# Altium schematic sheet MainPowerBoard.SchDoc
size B; SheetNumber: 2; SheetTotal: 5
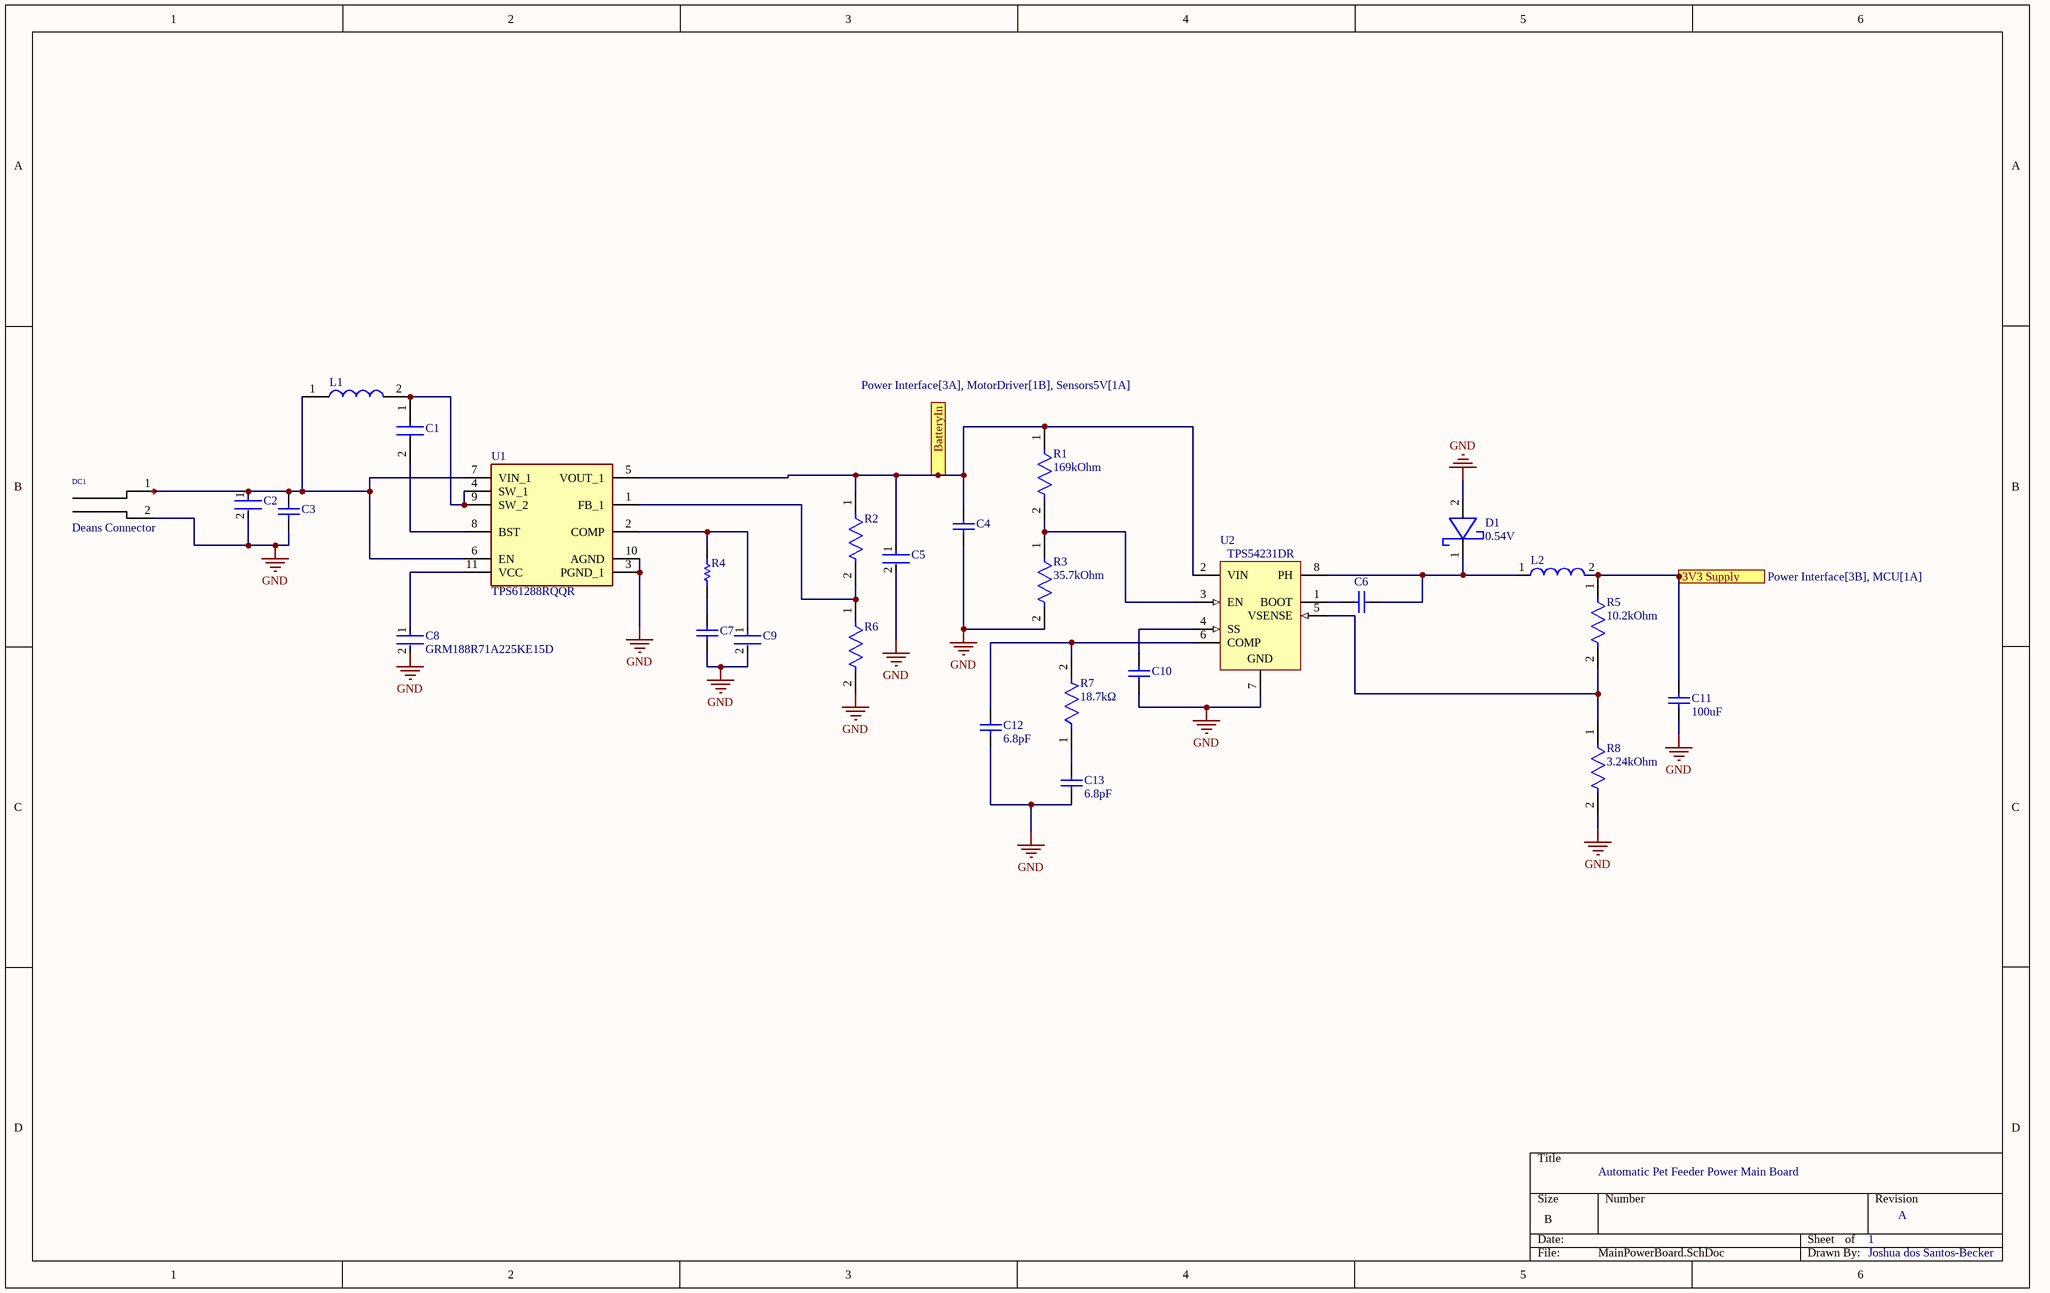
[diagram p0: MainPowerBoard.SchDoc]

## Parts
C1  EMK107B7104KA-T  [CAPC1608X95N]  (value not drawn)
C2  GRM188R60J106ME47D  [FP-GRM188-0_1-e0_2_0_55-IPC_A]  (value not drawn)
C3  GRM188R71H104KA93D  [CAPC1608X90X35ML10T15]  (value not drawn)
C4  (no value)  [FP-GRM32-IPC_A]
C5  GRM32ER61C476KE15L  [FP-GRM32E-0_3-0_2-IPC_C]  (value not drawn)
C6  (no value)  [CAPC1005X55X25LL05T10]
C7  GRM155R61A393KA01D  [CAPC1005X55X25NL05T10]  (value not drawn)
C8  GRM188R71A225KE15D  [FP-GRM188-0_1-e0_2_0_5-MFG]
C9  CL21C101JBANNNC  [FP-CL21-IPC_C]  (value not drawn)
C10  (no value)  [CAPC1005X55X25LL05T10]
C11  100uF  [CAP_0805]
C12  6.8pF  [Ccomp2]
C13  6.8pF  [Ccomp]
D1  0.54V  [SODFL260X100-2N]
DC1  Deans Connector  [Deans]
L1  XAL7070-222MEB  [XAL7070332MEB]  (value not drawn)
L2  (no value)  [WE-TI-L]
R1  169kOhm  [FP-CRCW0402-e3-IPC_B]
R2  CRCW0805931KFKEA  [RESC2012X50N]  (value not drawn)
R3  35.7kOhm  [FP-CRCW0402-e3-MFG]
R4  CRCW060339K2FKEA  [RESC1609X50X30LL10T20]  (value not drawn)
R5  10.2kOhm  [FP-CRCW0402-e3-MFG]
R6  CRCW080548K7FKEA  [FP-CRCW0805-e3-IPC_A]  (value not drawn)
R7  18.7kΩ  [FP-AC0402-IPC_A]
R8  3.24kOhm  [FP-CRCW0402-e3-MFG]
U1  TPS61288RQQR  [TPS61288RQQR]
U2  TPS54231DR  [D0008A_L]

## Ports
3V3 Supply (out, see Power Interface[3B], MCU[1A]), BatteryIn (see Power Interface[3A], MotorDriver[1B], Sensors5V[1A])

## Nets
GND: C2.2 C3.1 C4.1 C5.2 C7.2 C8.2 C9.2 C10.2 C11.2 C12.1 C13.2 D1.2 DC1.2 R3.2 R6.2 R8.2 U1.3(PGND_1) U1.10(AGND) U2.7(GND)
3V3 Supply: C11.1 L2.2 R5.1 ; port 3V3 Supply
BatteryIn: C4.2 C5.1 R1.1 R2.1 U1.5(VOUT_1) U2.2(VIN) ; port BatteryIn
NetC1_1: C1.1 L1.2 U1.4(SW_1) U1.9(SW_2)
NetC1_2: C1.2 U1.8(BST)
NetC2_1: C2.1 C3.2 DC1.1 L1.1 U1.6(EN) U1.7(VIN_1)
NetC6_1: C6.1 U2.1(BOOT)
NetC6_2: C6.2 D1.1 L2.1 U2.8(PH)
NetC7_1: C7.1 R4.2
NetC8_1: C8.1 U1.11(VCC)
NetC9_1: C9.1 R4.1 U1.2(COMP)
NetC10_1: C10.1 U2.4(SS)
NetC12_2: C12.2 R7.2 U2.6(COMP)
NetC13_1: C13.1 R7.1
NetR1_2: R1.2 R3.1 U2.3(EN)
NetR2_2: R2.2 R6.1 U1.1(FB_1)
NetR5_2: R5.2 R8.1 U2.5(VSENSE)

## Notes on the sheet
- Automatic Pet Feeder Power Main Board
- 1
- A
- Joshua dos Santos-Becker

## Library data of the parts
C1 = EMK107B7104KA-T: Capacitor; Manufacturer_Name: TAIYO YUDEN; Datasheet Link: http://www.farnell.com/datasheets/746258.pdf; Height: 0.95mm; Manufacturer_Part_Number: EMK107B7104KA-T; Mouser Part Number: 963-EMK107B7104KA-T; Mouser Price/Stock: https://www.mouser.co.uk/ProductDetail/TAIYO-YUDEN/EMK107B7104KA-T?qs=I6KAKw0tg2ybqzX8hKPgfw%3D%3D; Arrow Part Number: EMK107B7104KA-T; Arrow Price/Stock: https://www.arrow.com/en/products/emk107b7104ka-t/taiyo-yuden
C2 = CMP-2006-02792-2: Chip Multilayer Ceramic Capacitors for General Purpose, 0603, 10uF, X5R, 15%, 20%, 6.3V; Packaging: Tape and Reel; Voltage Rating (DC): 6.3V; Width: 0.031inch; Termination: SMD/SMT; Dielectric: X5R; Package Quantity: 4000; Voltage Rating: 6.3V; Capacitance: 10uF; Case/Package: 0603; Min Operating Temperature: -55°C; Voltage: 6.3V; Length: 1.6mm; Thickness: 0.035inch; Lead Free: Lead Free; Depth: 0.8mm; Case Code (Imperial): 0603; Max Operating Temperature: 85°C; Material: Ceramic; Height: 0.8mm; Tolerance: 20%; Mount: Surface Mount; REACH SVHC: No SVHC; Radiation Hardening: No; Case Code (Metric): 1608
C3 = CMP-2100-03643-1: Chip Capacitor, 0.1 uF, +/- 10%, 50 V, -55 to 125 degC, 0603 (1608 Metric), RoHS, Tape and Reel; Manufacturer: Murata; Dielectric Material: Ceramic; Voltage Rating: 50V; Capacitance: 100nF; Dielectric: X7R; Insulation Resistance: 10GR; Case Code (Metric): 1608; Lead Free: LeadFree; Depth: 0.8mm; Number of Pins: 2; Radiation Hardening: No; Case/Package: 0603; Manufacturer URL: http://www.murata.com/; Packaging: TapeandReel; Length: 1.6mm; Contact Plating: Tin; Datasheet URL: http://psearch.en.murata.com/capacitor/product/GRM188R71H104KA93%23.pdf; Tolerance: 10%; Case Code (Imperial): 0603; Min Operating Temperature: -55degC; RoHSCompliant: true; Voltage: 50V; Termination: SMD/SMT; Mount: SurfaceMount; Material: Ceramic; Package Quantity: 1; Height: 0.8mm; Thickness: 0.035inch; REACH SVHC: NoSVHC; Max Operating Temperature: 125degC; Width: 0.8mm; Package Reference: 0603; Voltage Rating (DC): 50V; Datasheet Version: 42675.0; Package Description: 2-Pin Surface Mount Device, Body 1.6 x 0.8 mm
C4 = Cin: GRM32ER61E226KE15L; Manufacturer: Murata Electronics North America; Temperature Characteristic: X5R; Possible Substitute: GRM32ER61E226KE15K; Other Names: 490-3889-2; Material: Ceramic; Capacitance: 22uF; Value: 22uF; Voltage - Rated: 25V; Tolerance: 10%; Digikey Description: CAP CER 22UF 25V X5R 1210; Mouser Description: Multilayer Ceramic Capacitors MLCC - SMD/SMT 1210 22uF 25volts X5R 10%; Device Class L2: Capacitors; Height: 2.7mm; Category: Cap; RoHS: TRUE; Operating Temperature: -55°C ~ 85°C; Temperature: -55°C to +85°C; Lead Free: Yes; Package: GRM32; Temperature Range High: +85°C; Package / Case: 1210 (3225 Metric); Standard Package: 1,000; Packaging: Cut Tape (CT); Thickness (Max): 0.106" (2.70mm); Automotive: No; Device Class L1: Passive Components; Temperature Range Low: -55°C; Size / Dimension: 0.126" L x 0.098" W (3.20mm x 2.50mm); ComponentLink2Description: Datasheet; Device Class L3: Ceramic Capacitors; Temperature Coefficient: X5R; ComponentLink2URL: https://search.murata.co.jp/Ceramy/image/img/A01X/G101/ENG/GRM32ER61E226KE15-01A.pdf; Voltage Rating: 25V; Manufacturer Part Number: GRM32ER61E226KE15L; Octopart: https://octopart.com/grm32er61e226ke15l-murata-197441; Applications: General Purpose; Mounting Type: Surface Mount, MLCC
C5 = CMP-2000-06362-2: CAP CER 47UF 16V X5R 1210; Tolerance: 10%; Material: Ceramic; Case Code (Metric): 3225; RoHS Compliant: Yes; Min Operating Temperature: -55°C; Radiation Hardening: No; Voltage: 16V; Package Quantity: 1; Case Code (Imperial): 1210; REACH SVHC: No SVHC; Capacitance: 47uF; Voltage Rating (DC): 16V; Dielectric: X5R; Case/Package: 1210; Length: 3.2mm; Voltage Rating: 16V; Packaging: Cut Tape; Width: 0.098inch; Number of Pins: 2; Lead Free: Lead Free; Height: 2.5mm; Mount: Surface Mount; Termination: SMD/SMT; Max Operating Temperature: 85°C; Thickness: 0.106inch; Depth: 2.5mm
C6 = Cboot: GRM155R71A104KA01D; Manufacturer: Murata; Rated Voltage: 10V; Capacitance: 100000pF; Dielectric: X7R; Tolerance (%): ±10%; Manufacturer URL: http://www.murata.com/; Datasheet Version: 02/2016; Datasheet URL: http://search.murata.co.jp/Ceramy/image/img/A01X/G101/ENG/GRM155R71A104KA01-01.pdf; Package Reference: 0402; Package Description: 2-Pin Surface Mount Device, Body 1 x 0.5 mm; Mounting Technology: SurfaceMount; Case Size/Dimension: 0402
C7 = CMP-2008-04563-1: Manufacturer: Murata; Part Number: GRM155R61A393KA01D
C8 = CMP-2006-02836-2: Chip Multilayer Ceramic Capacitors for General Purpose, 0603, 2.2uF, X7R, 15%, 10%, 10V; Case Code (Metric): 1608; Height: 0.8mm; Packaging: Cut Tape; Voltage: 10V; Lead Free: Lead Free; Min Operating Temperature: -55°C; Voltage Rating (DC): 10V; Max Operating Temperature: 125°C; Voltage Rating: 10V; Dielectric: X7R; Depth: 0.8mm; Case Code (Imperial): 0603; Termination: SMD/SMT; Case/Package: 0603; Number of Pins: 2; REACH SVHC: No SVHC; Mount: Surface Mount; Width: 0.031inch; Material: Ceramic; Capacitance: 2.2uF; Package Quantity: 1; Weight: 7.1E-05oz; Length: 1.6mm; Thickness: 0.035inch; Tolerance: 10%
C9 = CMP-13271-001949-1: CL21 Series 0805 100pF 50V ±5% Tolerance C0G Multilayer Ceramic Chip Capacitor; Temperature Coefficient: 300ppm/°C; Voltage Rating (DC): 50V; Material: Ceramic; Capacitance: 100pF; Height: 0.65mm; Thickness: 0.03inch; Case/Package: 0805; Voltage Rating: 50V; Max Operating Temperature: 125°C; Voltage: 50V; Dielectric: C0G; Length: 2mm; Case Code (Metric): 2012; Packaging: Tape and Reel; Tolerance: 5%; Min Operating Temperature: -55°C; Radiation Hardening: No; Lead Free: Lead Free; Contact Plating: Tin; Width: 0.049inch; Mount: Surface Mount; Case Code (Imperial): 0805; Depth: 1.25mm
C10 = CSS: GRM155R71C822KA01D; Manufacturer: Murata; Part Number: GRM155R71C822KA01D
C11 = CAP_0805: Capacitor SMD 0805 Generic
C12 = Ccomp2: 06031U6R8BAT2A
C13 = Ccomp: 06031U6R8BAT2A
D1 = Schottky
L1 = XAL7070-222MEB: Inductor; Manufacturer_Name: COILCRAFT; Datasheet Link: https://www.coilcraft.com/xal7070.cfm; Height: 7mm; Manufacturer_Part_Number: XAL7070-222MEB; Mouser Part Number: 994-XAL7070-222MEB; Mouser Price/Stock: https://www.mouser.co.uk/ProductDetail/Coilcraft/XAL7070-222MEB?qs=VJjuEbE9QBOHvtnxhiSHKw%3D%3D
L2 = PAS-IND-INDUCTOR-2: 744772390; Inductance: 39.0 ÂµH; ComponentLink1Description: Manufacturer Link; ComponentLink1URL: http://www.we-online.com; PackageDescription: THT Inductor, 2-Leads, Body 7.8 x 7.8 mm; DatasheetVersion: ver 8, Oct-2009; ComponentLink2URL: http://www.we-online.de/katalog/media/pdf/744772390.pdf; PackageReference: WE-TI-L; PackageVersion: 2006; ComponentLink2Description: Datasheet
R1 = CMP-2002-08234-2: CRCW0402169KFKED; Max Power Dissipation: 63mW; Voltage Rating: 50V; Resistance: 169kR; Temperature Coefficient: 100ppm/°C; Tolerance: 1%; Max Operating Temperature: 155°C; Case/Package: 0402; Depth: 0.5mm; Number of Pins: 2; Lead Free: Lead Free; Radiation Hardening: No; Contact Plating: Tin; Width: 0.02inch; Number of Terminations: 2; Height: 0.35mm; Length: 1mm; Package Quantity: 10; Power Rating: 63mW; Packaging: Tape and Reel; Military Standard: Not; Case Code (Imperial): 0402; Weight: 2.3E-05oz; Voltage Rating (DC): 50V; Case Code (Metric): 1005; Composition: Thick Film; Features: Automotive AEC-Q200; Termination: SMD/SMT; Mount: Surface Mount; Min Operating Temperature: -55°C
R2 = CRCW0805931KFKEA: Resistor; Manufacturer_Name: Vishay; Datasheet Link: http://www.vishay.com/docs/20035/dcrcwe3.pdf; Height: 0.5mm; Manufacturer_Part_Number: CRCW0805931KFKEA; Mouser Part Number: 71-CRCW0805-931K-E3; Mouser Price/Stock: https://www.mouser.com/Search/Refine.aspx?Keyword=71-CRCW0805-931K-E3
R3 = CMP-2002-08543-2: CRCW040235K7FKED; Tolerance: 1%; Voltage Rating (DC): 50V; Power Rating: 63mW; Resistance: 35.7kR; Temperature Coefficient: 100ppm/°C; Case Code (Metric): 1005; Voltage Rating: 50V; Termination: SMD/SMT; Height: 0.35mm; Working Voltage: 50V; Width: 0.02inch; Min Operating Temperature: -55°C; Features: Automotive AEC-Q200; Radiation Hardening: No; Case/Package: 0402; Depth: 0.5mm; Lead Free: Lead Free; Contact Plating: Tin; Max Power Dissipation: 63mW; Max Operating Temperature: 155°C; Weight: 2.3E-05oz; Number of Pins: 2; Packaging: Tape and Reel; Number of Terminations: 2; Composition: Thick Film; Length: 1mm; Military Standard: Not; Package Quantity: 10; Case Code (Imperial): 0402
R4 = CMP-2000-03290-1: Manufacturer: Vishay Dale; Part Number: CRCW060339K2FKEA
R5 = CMP-2002-08138-2: CRCW040210K2FKED; Temperature Coefficient: 100ppm/°C; Power Rating: 63mW; Voltage Rating: 50V; Resistance: 10.2kR; Tolerance: 1%; Height: 0.35mm; Features: Automotive AEC-Q200; Contact Plating: Tin; Radiation Hardening: No; Width: 0.5mm; Case/Package: 0402; Depth: 0.5mm; Termination: SMD/SMT; Mount: Surface Mount; Packaging: Tape and Reel; Min Operating Temperature: -55°C; Package Quantity: 10; Number of Pins: 2; Composition: Thick Film; Length: 1mm; Max Power Dissipation: 63mW; Case Code (Imperial): 0402; Military Standard: Not; Case Code (Metric): 1005; Number of Terminations: 2; Weight: 2.3E-05oz; Max Operating Temperature: 155°C
R6 = CMP-2001-03948-2: RES Thick Film, 48.7kΩ, 1%, 0.125W, 100ppm/°C, 0805; Voltage Rating: 150V; Resistance: 48.7kR; Max Power Dissipation: 125mW; Military Standard: Not; Termination: SMD/SMT; Contact Plating: Tin; Min Operating Temperature: -55°C; Case Code (Metric): 2012; Width: 0.049inch; Temperature Coefficient: 100ppm/°C; Length: 2mm; Depth: 1.25mm; Packaging: Tape and Reel; Weight: 0.000194oz; Features: Automotive AEC-Q200; Number of Pins: 2; Max Operating Temperature: 155°C; Number of Terminations: 2; Case/Package: 0805; Lead Free: Lead Free; Tolerance: 1%; Case Code (Imperial): 0805; Package Quantity: 10; Voltage Rating (DC): 150V; Radiation Hardening: No; Power Rating: 125mW; Composition: Thick Film; Height: 0.45mm
R7 = CMP-03412-024020-2: AC0402FR-0718K7L; Tolerance: 1%; Max Power Dissipation: 63mW; Temperature Coefficient: 100ppm/°C; Resistance: 18.7kR; Resistor Type: Thick Film; Height: 0.015inch; Case/Package: 0402; Features: Moisture Resistant; Number of Terminations: 2; Min Operating Temperature: -55°C; Length: 0.039inch; RoHS Compliant: Yes; Packaging: Tape and Reel; Width: 0.02inch; Series: AC; Max Operating Temperature: 155°C
R8 = CMP-2002-08579-2: CRCW04023K24FKED; Voltage Rating: 50V; Max Power Dissipation: 63mW; Tolerance: 1%; Resistance: 3.24kR; Temperature Coefficient: 100ppm/°C; Packaging: Tape and Reel; Composition: Thick Film; Depth: 0.5mm; Weight: 2.3E-05oz; Number of Terminations: 2; Radiation Hardening: No; Voltage Rating (DC): 50V; Lead Free: Lead Free; Case Code (Metric): 1005; Height: 0.35mm; Width: 0.5mm; Max Operating Temperature: 155°C; Mount: Surface Mount; Package Quantity: 10; Number of Pins: 2; Min Operating Temperature: -55°C; Features: Automotive AEC-Q200; Case Code (Imperial): 0402; Power Rating: 63mW; Military Standard: Not; Contact Plating: Tin; Length: 1mm; Case/Package: 0402; Termination: SMD/SMT
U2 = CMP-0323-00207-3: Buck Step Down Regulator with 3.5 to 28 V Input and 0.8 to 25 V Output, -40 to 150 degC, 8-Pin SOIC (D), Green (RoHS & no Sb/Br); Manufacturer: Texas Instruments; Vout(Min)(V): 0.8; Iout(Max)(A): 2; SubFamily: Step-Down Regulator; Vin(Min)(V): 3.5; Rating: Catalog; Duty Cycle(Max)(%): 90; Switch Current Limit(Typ)(A): 2.3; Iq(Typ)(mA): 0.11; Regulated Outputs(#): 1; Vout(Max)(V): 25; Vin(Max)(V): 28; ComponentLink2Description: Package Specification; PackageVersion: revM, Jun-2011; Topology: Buck; PackageReference: D0008A; DatasheetVersion: SLUS851C; Code_JEDEC: MS-012AA; PartNumber: TPS54231DR; ComponentLink2URL: http://www.ti.com/litv/pdf/msoi002j; Eco-Plan: Green (RoHS & no Sb/Br); ComponentLink1URL: http://www.ti.com/general/docs/lit/getliterature.tsp?genericPartNumber=TPS54231&fileType=pdf; ComponentLink1Description: Datasheet; PackageDescription: 8-Pin Plastic Small Outline Integrated Circuit, 4.9 x 3.9 mm, Pitch 1.27 mm Pitch; ComponentLink3URL: Samples URL:http://www.ti.com/product/tps54231#samples; Mounting Technology: Surface Mount; ComponentLink3Description: URL Link1